# Altium project Board.PrjPCB
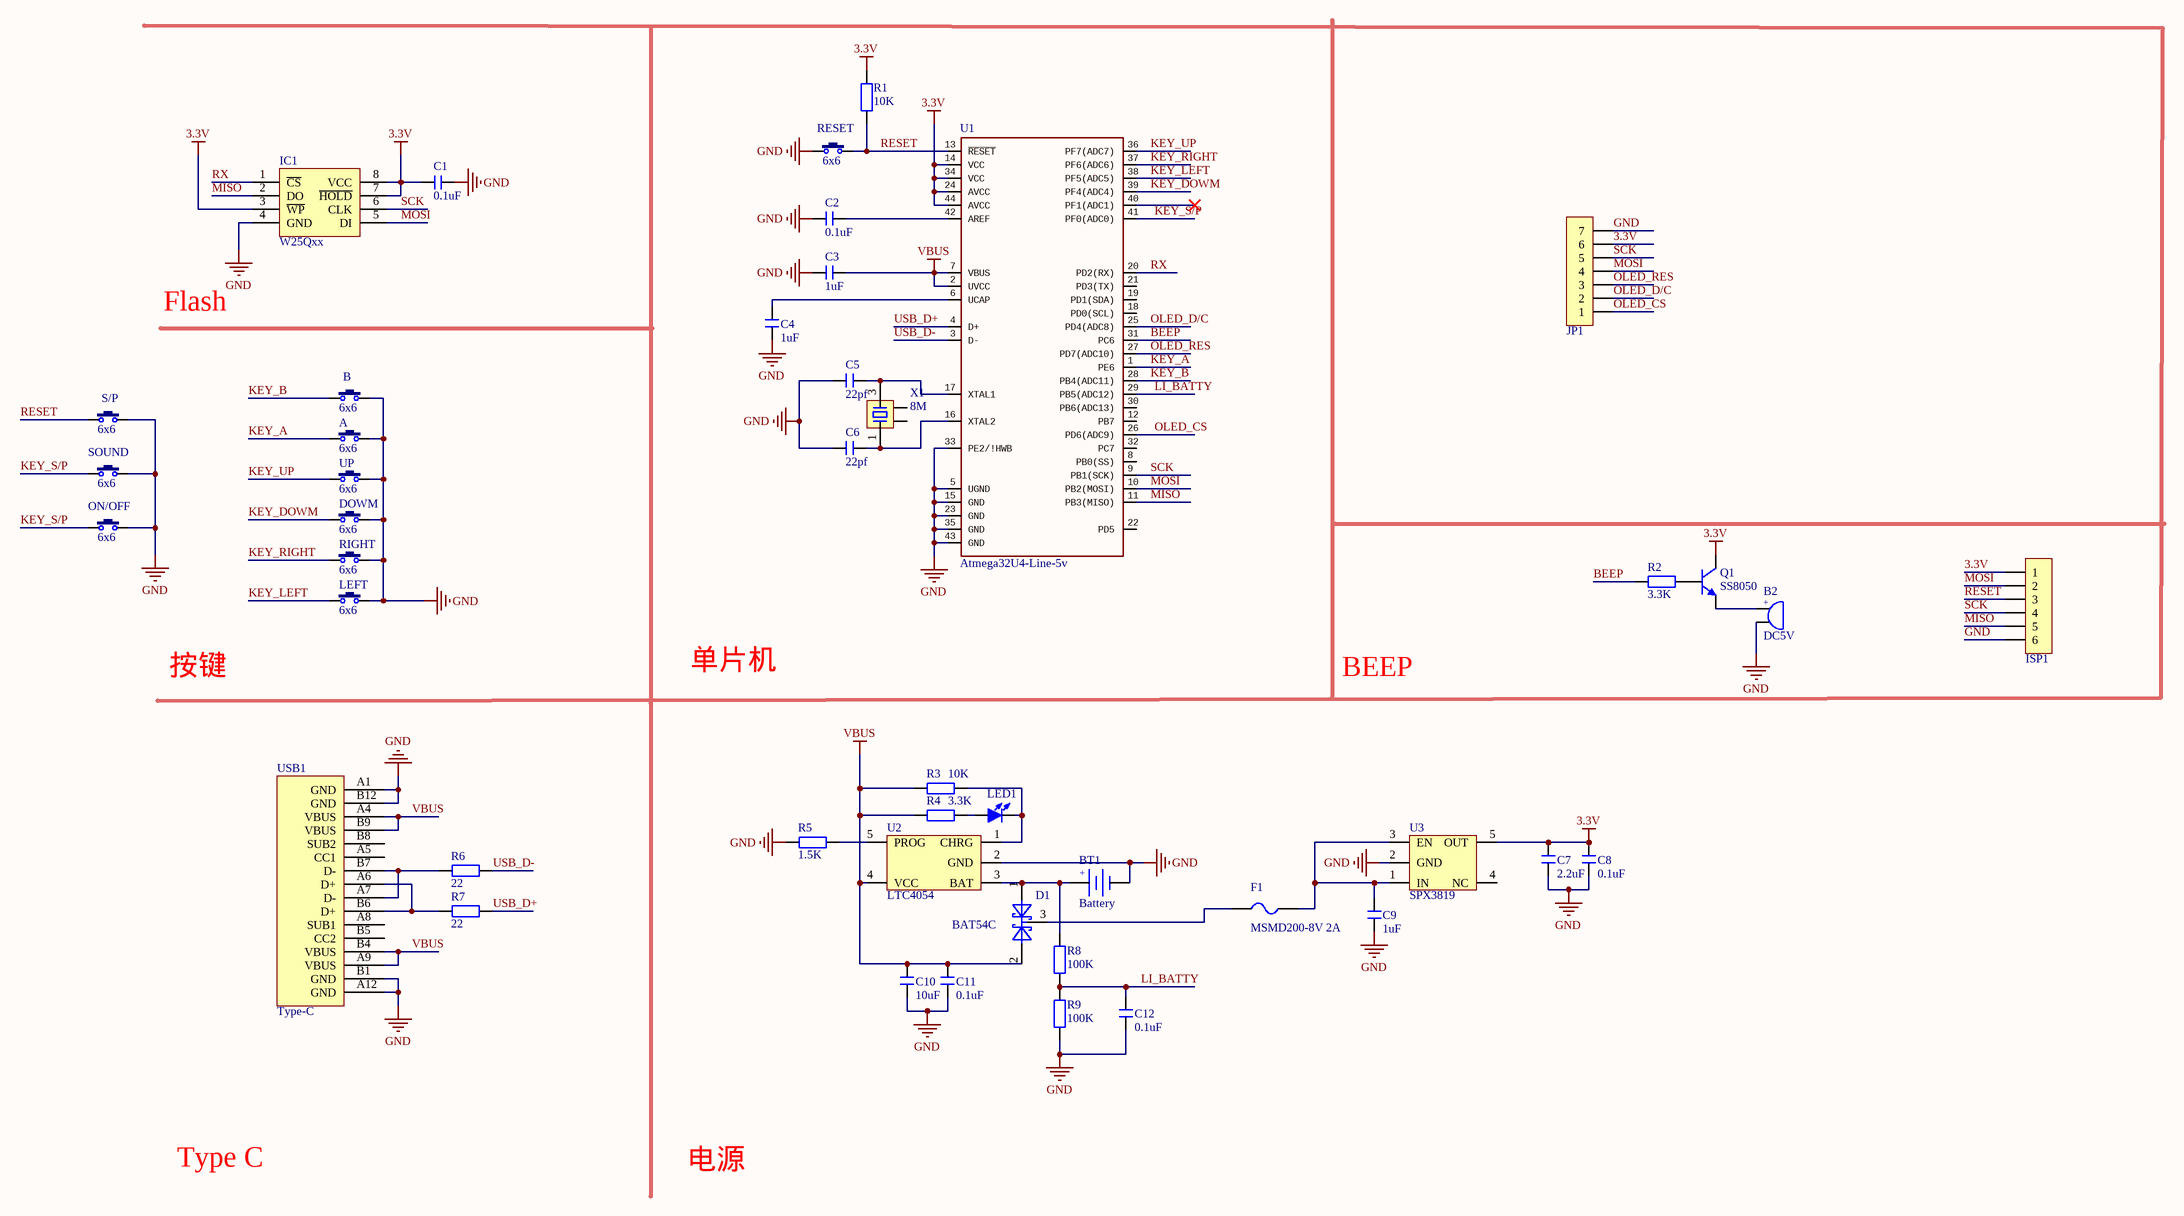
[diagram p0: Board.SchDoc]
1 sheet, 45 parts. Net scope: global (net labels, ports and power ports of the same name join across sheets).
Board file: Board.PcbDoc

## Sheet Board.SchDoc
size A2

### Parts
A  6x6  [Touch key 2]
B  6x6  [Touch key 2]
B2  DC5V  [BEEP-SMD 5x5x2]
BT1  Battery  [Li-Bettery SMD]
C1  0.1uF  [C 0603]
C2  0.1uF  [C 0603]
C3  1uF  [C 0603]
C4  1uF  [C 0603]
C5  22pf  [C 0603]
C6  22pf  [C 0603]
C7  2.2uF  [C 0603]
C8  0.1uF  [C 0603]
C9  1uF  [C 0603]
C10  10uF  [C 0603]
C11  0.1uF  [C 0603]
C12  0.1uF  [C 0603]
D1  BAT54C  [SOT23-3M]
DOWM  6x6  [Touch key 2]
F1  MSMD200-8V 2A  [FU 0603]
IC1  W25Qxx  [SOP8W_N]
ISP1  HDR-1X6  [IPS]  (value not drawn)
JP1  HDR-1X7  [HDR-1X7]  (value not drawn)
LED1  (no value)  [LED 0603B]
LEFT  6x6  [Touch key 2]
ON/OFF  6x6  [Touch key 2]
Q1  SS8050  [SOT23-3M]
R1  10K  [R 0603]
R2  3.3K  [R 0603]
R3  10K  [R 0603]
R4  3.3K  [R 0603]
R5  1.5K  [R 0603]
R6  22  [R 0603]
R7  22  [R 0603]
R8  100K  [R 0603]
R9  100K  [R 0603]
RESET  6x6  [Touch key 2]
RIGHT  6x6  [Touch key 2]
S/P  6x6  [Touch key 2]
SOUND  6x6  [Touch key 2]
U1  Atmega32U4-Line-5v  [LQFP-QFN]
U2  LTC4054  [SOT23-5M]
U3  SPX3819  [SOT23-5M]
UP  6x6  [Touch key 2]
USB1  Type-C  [Type C 16p]
X1  8M  [XTAL-3225]

### Nets
3.3V: C1.1 C7.2 C8.2 IC1.3(~{WP}) IC1.7(~{HOLD}) IC1.8(VCC) ISP1.1 JP1.6 Q1.3(C) R1.2 U1.14(VCC) U1.24(AVCC) U1.34(VCC) U1.44(AVCC) U3.5(OUT)
GND: A.2 B.2 B2.2 BT1.2 C1.2 C2.1 C3.1 C4.2 C5.1 C6.1 C7.1 C8.1 C9.1 C10.1 C11.1 C12.1 DOWM.2 IC1.4(GND) ISP1.6 JP1.7 LEFT.2 ON/OFF.2 R5.2 R9.2 RESET.1 RIGHT.2 S/P.2 SOUND.2 U1.5(UGND) U1.15(GND) U1.23(GND) U1.33(PE2/!HWB) U1.35(GND) U1.43(GND) U2.2(GND) U3.2(GND) UP.2 USB1.A1(GND) USB1.A12(GND) USB1.B1(GND) USB1.B12(GND)
VBUS: C3.2 C10.2 C11.2 D1.2 R3.1 R4.2 U1.2(UVCC) U1.7(VBUS) U2.4(VCC) USB1.A4(VBUS) USB1.A9(VBUS) USB1.B4(VBUS) USB1.B9(VBUS)
BEEP: R2.1 U1.31(PC6)
KEY_A: A.1 U1.1(PE6)
KEY_B: B.1 U1.28(PB4(ADC11))
KEY_DOWM: DOWM.1 U1.39(PF4(ADC4))
KEY_LEFT: LEFT.1 U1.38(PF5(ADC5))
KEY_RIGHT: RIGHT.1 U1.37(PF6(ADC6))
KEY_S/P: ON/OFF.1 SOUND.1 U1.41(PF0(ADC0))
KEY_UP: U1.36(PF7(ADC7)) UP.1
LI_BATTY: C12.2 R8.2 R9.1 U1.29(PB5(ADC12))
MISO: IC1.2(DO) ISP1.5 U1.11(PB3(MISO))
MOSI: IC1.5(DI) ISP1.2 JP1.4 U1.10(PB2(MOSI))
OLED_CS: JP1.1 U1.26(PD6(ADC9))
OLED_D/C: JP1.2 U1.25(PD4(ADC8))
OLED_RES: JP1.3 U1.27(PD7(ADC10))
RESET: ISP1.3 R1.1 RESET.2 S/P.1 U1.13(~{RESET})
RX: IC1.1(~{CS}) U1.20(PD2(RX))
SCK: IC1.6(CLK) ISP1.4 JP1.5 U1.9(PB1(SCK))
USB_D+: R7.1 U1.4(D+)
USB_D-: R6.1 U1.3(D-)
NetB2_1: B2.1 Q1.2(E)
NetBT1_1: BT1.1 D1.1 R8.1 U2.3(BAT)
NetC2_2: C2.2 U1.42(AREF)
NetC4_1: C4.1 U1.6(UCAP)
NetC5_2: C5.2 U1.17(XTAL1) X1.3
NetC6_2: C6.2 U1.16(XTAL2) X1.1
NetC9_2: C9.2 F1.2 U3.1(IN) U3.3(EN)
NetD1_3: D1.3 F1.1
NetLED1_1: LED1.1(A) R4.1
NetLED1_2: LED1.2(K) R3.2 U2.1(CHRG)
NetQ1_1: Q1.1(B) R2.2
NetR5_1: R5.1 U2.5(PROG)
NetR6_2: R6.2 USB1.A7(D-) USB1.B7(D-)
NetR7_2: R7.2 USB1.A6(D+) USB1.B6(D+)

Not connected (* = marked no-connect by the designer): U1 8(PB0(SS)) 12(PB7) 18(PD0(SCL)) 19(PD1(SDA)) 21(PD3(TX)) 22(PD5) 30(PB6(ADC13)) 32(PC7) 40(PF1(ADC1))*; U3 4(NC); USB1 A5(CC1) A8(SUB1) B5(CC2) B8(SUB2); X1 2 4

### Notes on the sheet
- Flash
- 按键
- 单片机
- BEEP
- Type C
- 电源
- (in symbol Battery) +
- (in symbol BEEP) +

### Library data of the parts
A B DOWM LEFT ON/OFF RESET RIGHT S/P SOUND UP = SW SMD-2: Arduboy 用
B2 = BEEP: 蜂鸣器; 版权归属: 黎明电子style; BOM名称: 蜂鸣器; 学习资源: https://lmdzstyle.taobao.com/
BT1 = Battery: 锂电池
C1-C12 = C: 无极性贴片电容; 版权归属: 黎明电子style; BOM名称: 无极性贴片电容; 学习资源: https://lmdzstyle.taobao.com/
D1 = BAT54C: 双肖基特二极管
F1 = FU: 贴片保险丝; 版权归属: 黎明电子style; BOM名称: 贴片保险丝; 学习资源: https://lmdzstyle.taobao.com/
IC1 = W25Qxx: 外置Flash; 版权归属: 黎明电子style; BOM名称: 外置Flash; 学习资源: https://lmdzstyle.taobao.com/
ISP1 = Header 6: 6P接插件; 版权归属: 黎明电子style; BOM名称: 6P接插件; 学习资源: https://lmdzstyle.taobao.com/
JP1 = Header 7: 7P接插件; 版权归属: 黎明电子style; BOM名称: 7P接插件; 学习资源: https://lmdzstyle.taobao.com/
LED1 = LED-SMD: 贴片LED; 版权归属: 黎明电子style; BOM名称: 贴片LED; 学习资源: https://lmdzstyle.taobao.com/
Q1 = 8050-SMD: 高频放大-NPN型; 版权归属: 黎明电子style; 属性: 40V 1.5A 1W 100MHZ; BOM名称: 高频放大-NPN型; 学习资源: https://lmdzstyle.taobao.com/
R1-R9 = R: 贴片电阻; 版权归属: 黎明电子style; BOM名称: 贴片电阻; 学习资源: https://lmdzstyle.taobao.com/
U2 = LTC4054: 充电管理
U3 = SPX3819: 3.3V LDO 稳压 /
USB1 = Type-C Socket: USB 3.1  单排16PIN四脚插板(L=7.35) 一体式MD; ComponentLink1Description: USB 3.1 C TYPE单排16PIN四脚插板(L=7.35) 一体式MD; ComponentLink1URL: https://item.szlcsc.com/293008.html
X1 = XTAL-4: 4脚晶振; 版权归属: 黎明电子style; BOM名称: 4脚晶振; 学习资源: https://lmdzstyle.taobao.com/